# Altium project CONTROL BARRAS DE CONTEO.PrjPcb
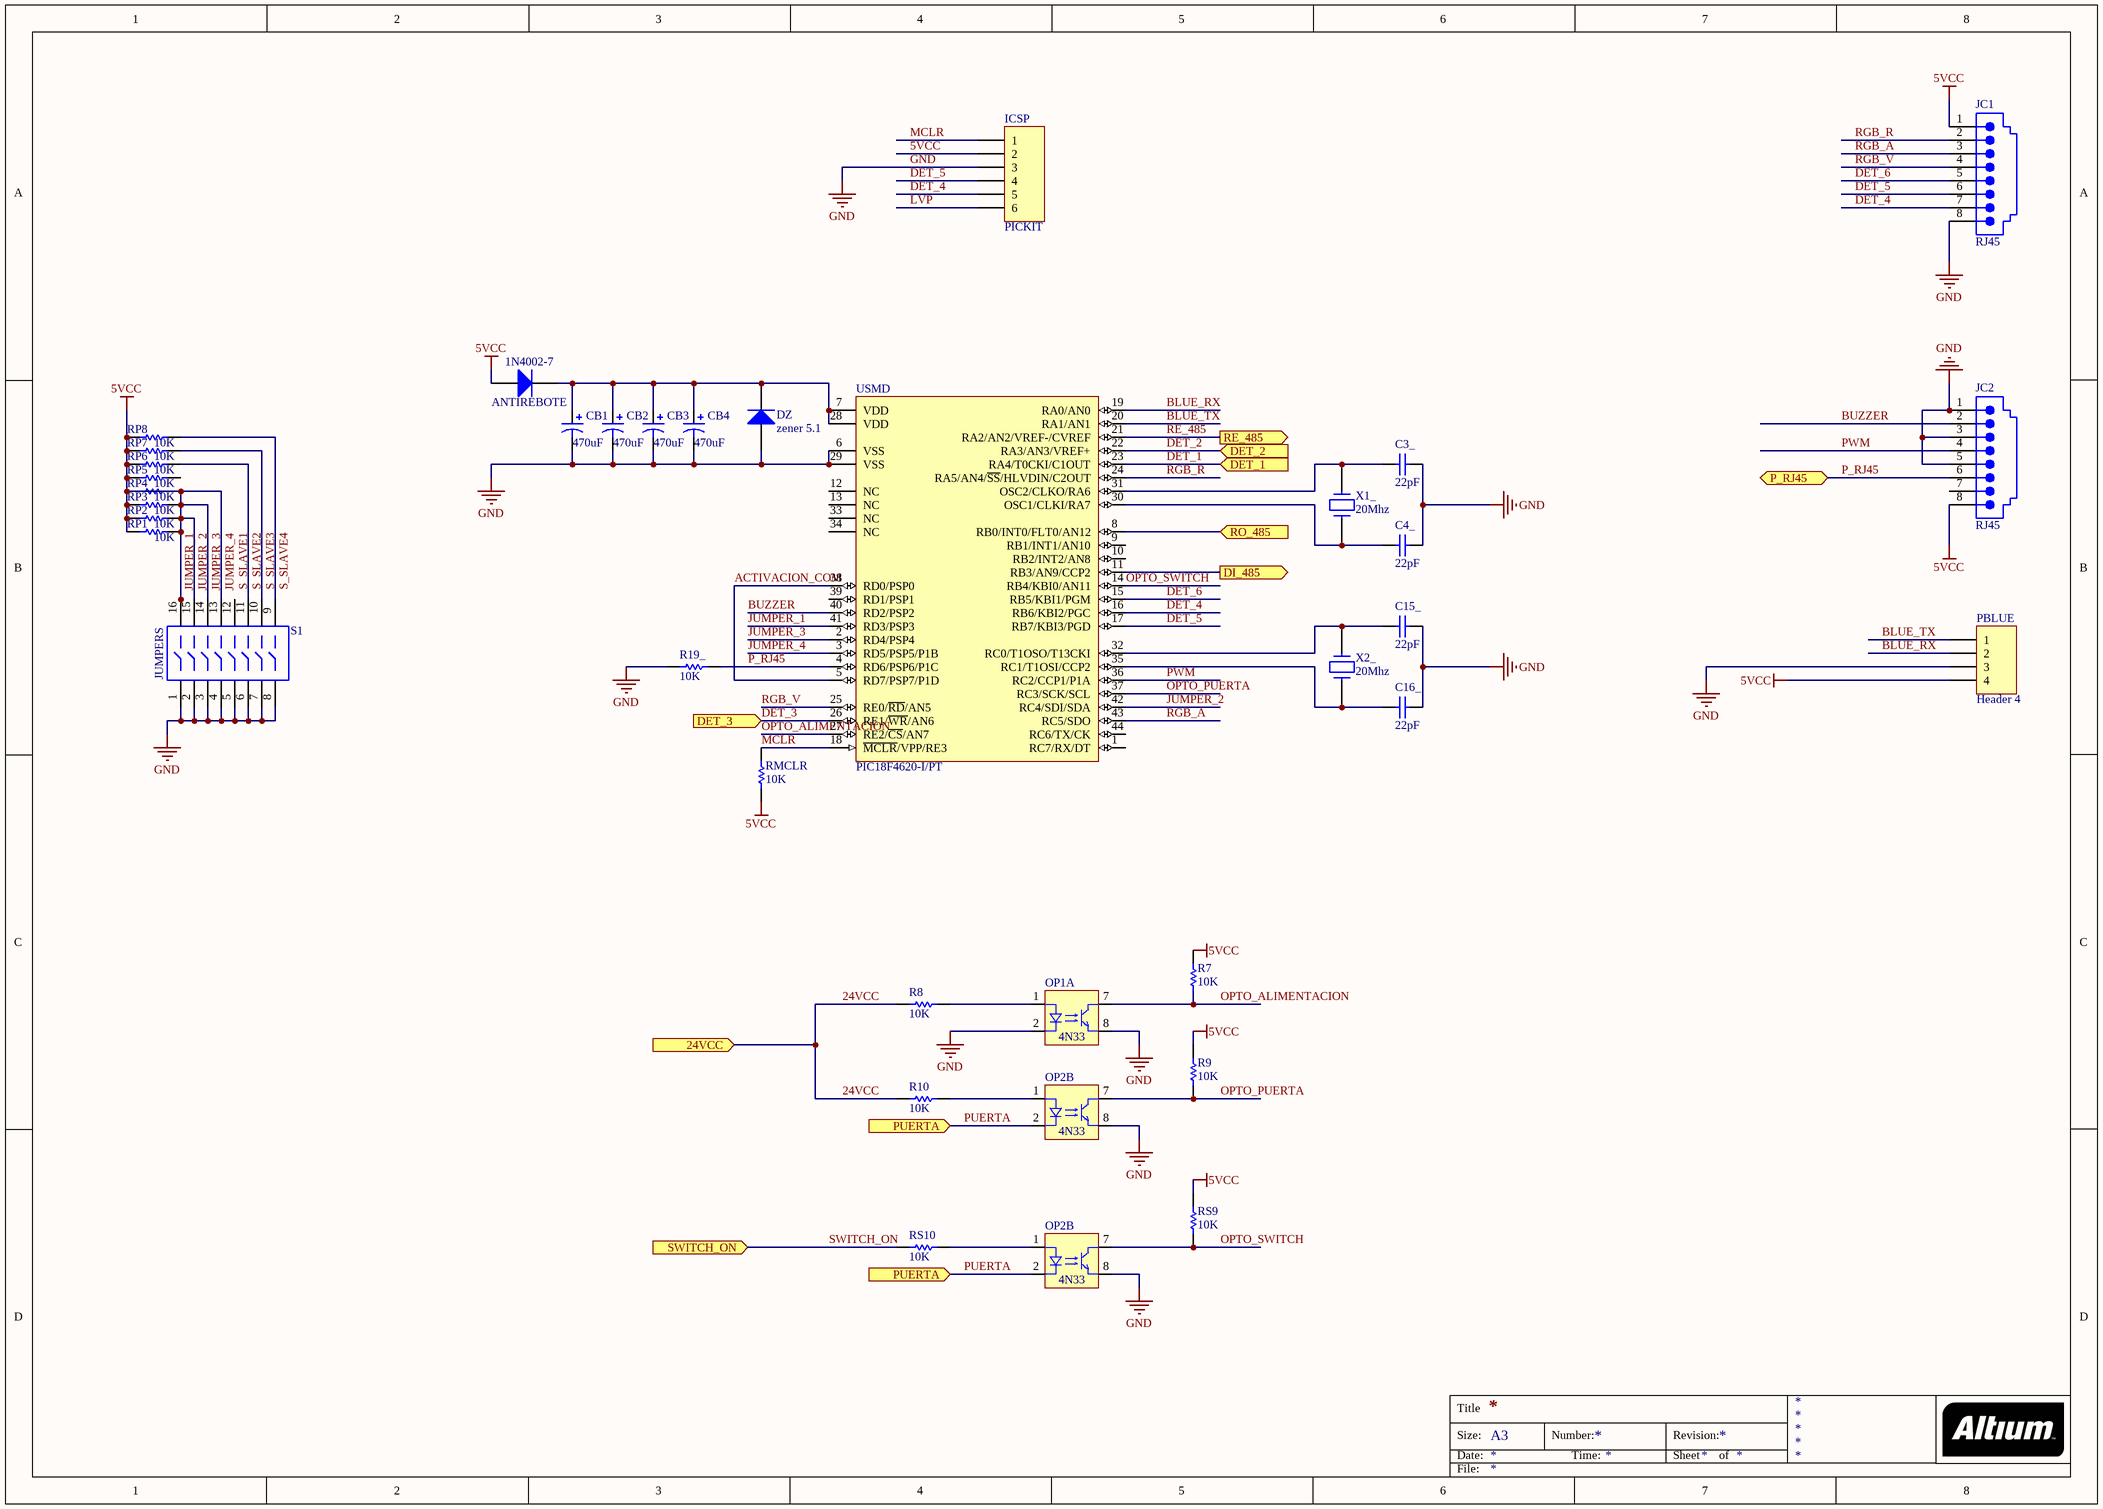
[diagram p0: MDL_CONTROL.SchDoc]
3 sheets, 58 parts. Net scope: flat (ports and power ports of the same name join across sheets).
Board file: PCB_CPU_1.PcbDoc
Sheets:
  MDL_CONTROL.SchDoc
  MDL_FUENTE_5V.SchDoc
  MDL-485.SchDoc

## Sheet MDL_CONTROL.SchDoc
size A3

### Parts
(Parts that share a designator on the sheet are numbered #1, #2 ... from top to bottom, then left to right.)
1N4002-7  ANTIREBOTE  [1N4000]
C3_  value 22pF  [VP31-2.5]  (hidden comment: VP31BA220JB)
C4_  value 22pF  [VP31-2.5]  (hidden comment: VP31BA220JB)
C15_  value 22pF  [VP31-2.5]  (hidden comment: VP31BA220JB)
C16_  value 22pF  [VP31-2.5]  (hidden comment: VP31BA220JB)
CB1  value 470uF  [C1000UF]  (hidden comment: Cap Pol1)
CB2  value 470uF  [C1000UF]  (hidden comment: Cap Pol1)
CB3  value 470uF  [C1000UF]  (hidden comment: Cap Pol1)
CB4  value 470uF  [C1000UF]  (hidden comment: Cap Pol1)
DZ  zener 5.1  [1N4000]
ICSP  PICKIT  [HDR1X6]
JC1  RJ45  [15-43-6233]
JC2  RJ45  [15-43-6233]
OP1  4N33  [4n35_4n33_6pines]  (part A of 2)
OP2#1  4N33  [4n35_4n33_6pines]  (part B of 2)
OP2#2  4N33  [4n35_4n33_6pines]  (part B of 2)
PBLUE  Header 4  [HDR1X4]
R7  value 10K  [AXIAL-0.3]  (hidden comment: Res)
R8  value 10K  [AXIAL-0.3]  (hidden comment: Res)
R9  value 10K  [AXIAL-0.3]  (hidden comment: Res)
R10  value 10K  [AXIAL-0.3]  (hidden comment: Res)
R19_  value 10K  [AXIAL-0.3]  (hidden comment: Res)
RMCLR  value 10K  [AXIAL-0.3]  (hidden comment: Res)
RP1  value 10K  [AXIAL-0.3]  (hidden comment: Res)
RP2  value 10K  [AXIAL-0.3]  (hidden comment: Res)
RP3  value 10K  [AXIAL-0.3]  (hidden comment: Res)
RP4  value 10K  [AXIAL-0.3]  (hidden comment: Res)
RP5  value 10K  [AXIAL-0.3]  (hidden comment: Res)
RP6  value 10K  [AXIAL-0.3]  (hidden comment: Res)
RP7  value 10K  [AXIAL-0.3]  (hidden comment: Res)
RP8  value 10K  [AXIAL-0.3]  (hidden comment: Res)
RS9  value 10K  [AXIAL-0.3]  (hidden comment: Res)
RS10  value 10K  [AXIAL-0.3]  (hidden comment: Res)
S1  JUMPERS  [DIP-16-KEY]
USMD  PIC18F4620-I/PT  [MCHP-TQFP-PT44_N]
X1_  20Mhz  [XTAL-1]
X2_  20Mhz  [XTAL-1]

### Ports
24VCC (in), DET_1 (in), DET_2 (in), DET_3 (in), DI_485 (out), P_RJ45 (bidir), PUERTA (in), RE_485 (out), RO_485 (in), SWITCH_ON (in)

### Nets
5VCC: 1N4002-7.1(A) ICSP.2 JC1.1 JC2.8 PBLUE.4 R7.2 R9.2 RMCLR.2 RP1.1 RP1.2 RP2.1 RP2.2 RP3.1 RP3.2 RP4.1 RP4.2 RP5.2 RP6.2 RP7.2 RP8.2 RS9.2 S1.13 S1.14 S1.15 S1.16 USMD.2(RD4/PSP4) USMD.3(RD5/PSP5/P1B) USMD.41(RD3/PSP3) USMD.42(RC4/SDI/SDA)  [also labelled JUMPER_1, JUMPER_2, JUMPER_3, JUMPER_4]
GND: C3_.2 C4_.1 C15_.2 C16_.1 CB1.2 CB2.2 CB3.2 CB4.2 DZ.1(A) ICSP.3 JC1.8 JC2.1 JC2.3 JC2.5 OP1.2(K) OP1.8(E) OP2#1.8(E) OP2#2.8(E) PBLUE.3 R19_.2 S1.1 S1.2 S1.3 S1.4 S1.5 S1.6 S1.7 S1.8 USMD.6(VSS) USMD.29(VSS)
24VCC: R8.1 R10.1 ; port 24VCC
ACTIVACION_COM: USMD.5(RD7/PSP7/P1D) USMD.38(RD0/PSP0)
BLUE_RX: PBLUE.2 USMD.19(RA0/AN0)
BLUE_TX: PBLUE.1 USMD.20(RA1/AN1)
BUZZER: JC2.2 USMD.40(RD2/PSP2)
DET_1: USMD.23(RA4/T0CKI/C1OUT) ; port DET_1
DET_2: USMD.22(RA3/AN3/VREF+) ; port DET_2
DET_3: USMD.26(RE1/~{WR}/AN6) ; port DET_3
DET_4: ICSP.5 JC1.7 USMD.16(RB6/KBI2/PGC)
DET_5: ICSP.4 JC1.6 USMD.17(RB7/KBI3/PGD)
DET_6: JC1.5 USMD.15(RB5/KBI1/PGM)
LVP: ICSP.6
MCLR: ICSP.1 RMCLR.1 USMD.18(~{MCLR}/VPP/RE3)
OPTO_ALIMENTACION: OP1.7(C) R7.1 USMD.27(RE2/~{CS}/AN7)
OPTO_PUERTA: OP2#1.7(C) R9.1 USMD.37(RC3/SCK/SCL)
OPTO_SWITCH: OP2#2.7(C) RS9.1 USMD.14(RB4/KBI0/AN11)
P_RJ45: JC2.6 R19_.1 USMD.4(RD6/PSP6/P1C) ; port P_RJ45
PUERTA: OP2#1.2(K) OP2#2.2(K) ; port PUERTA
PWM: JC2.4 USMD.36(RC2/CCP1/P1A)
RE_485: USMD.11(RB3/AN9/CCP2) USMD.21(RA2/AN2/VREF-/CVREF) ; port RE_485, port DI_485  [project net DI_485]
RGB_A: JC1.3 USMD.43(RC5/SDO)
RGB_R: JC1.2 USMD.24(RA5/AN4/~{SS}/HLVDIN/C2OUT)
RGB_V: JC1.4 USMD.25(RE0/~{RD}/AN5)
RO_485: USMD.8(RB0/INT0/FLT0/AN12) ; port RO_485
S_SLAVE2: RP6.1 S1.11
S_SLAVE3: RP7.1 S1.10
S_SLAVE4: RP8.1 S1.9
SWITCH_ON: RS10.1 ; port SWITCH_ON
Net1N4002-7_2: 1N4002-7.2(K) CB1.1 CB2.1 CB3.1 CB4.1 DZ.2(K) USMD.7(VDD) USMD.28(VDD)
NetC3__1: C3_.1 USMD.31(OSC2/CLKO/RA6) X1_.1
NetC4__2: C4_.2 USMD.30(OSC1/CLKI/RA7) X1_.2
NetC15__1: C15_.1 USMD.32(RC0/T1OSO/T13CKI) X2_.1
NetC16__2: C16_.2 USMD.35(RC1/T1OSI/CCP2) X2_.2
NetOP1_1: OP1.1(A) R8.2
NetOP2#1_1: OP2#1.1(A) R10.2
NetOP2#2_1: OP2#2.1(A) RS10.2

Not connected (* = marked no-connect by the designer): JC2 7; RP5 1; S1 12; USMD 1(RC7/RX/DT) 9(RB1/INT1/AN10) 10(RB2/INT2/AN8) 12(NC) 13(NC) 33(NC) 34(NC) 39(RD1/PSP1) 44(RC6/TX/CK)

### Notes on the sheet
- Labels drawn without touching a wire or pin: S_SLAVE1
- Title
- Size:
- Date:
- A3
- Number:
- Time:
- Revision:
- Sheet
- of
- File:

### Library data of the parts
1N4002-7 DZ = Diodo: Diodo rectificador
C3_ C4_ C15_ C16_ = VP31BA220JB: Dipped Radial Multilayer Ceramic Capacitor COG (NPO): 22pF, 100V; Note: See Datasheet for other packages & tolerances; Published: 17-Dec-2003; DatasheetDocument: 2-Jan-2002; PackageDocument: 8-Feb-2002; PackageReference: VP31-2.5; Publisher: Altium Limited; ComponentLink1Description: Manufacturer Link; ComponentLink1URL: http://www.vishay.com/
CB1-CB4 = Cap Pol1: Polarized Capacitor (Radial); Published: 8-Jun-2000; LatestRevisionDate: 17-Jul-2002; LatestRevisionNote: Re-released for DXP Platform.; PackageReference: RB7.6-15; Publisher: Altium Limited
ICSP = Header 6: Header, 6-Pin; LatestRevisionDate: 17-Jul-2002; LatestRevisionNote: Re-released for DXP Platform.; Publisher: Altium Limited
JC1 JC2 = 15-43-6233: Right Angle, Standard Profile, RJ45-Keyed, Flange Mount PCB Jack; Ports: 1; Positions/Loaded: Port1 - 8 Keyed/8; PerformanceCategory: 3; PCB_Mounting: Thru-Hole; ComponentAvailability: Obsolete; DrillSize: Nominal, Rounded to nearest 0.05mm; PCB_Layout: Complies with Manufacturer's Recommendation.; Published: 25-Jun-2002; DatasheetDocument: 18-Dec-2001; PackageDocument: 18-Dec-2001; PackageReference: 15-43-6233; Publisher: Altium Limited; ComponentLink1Description: Manufacturer Link; ComponentLink1URL: http://www.molex.com/; ComponentLink2Description: Datasheet; ComponentLink2URL: http://www.molex.com/cmc_upload/common_files/1212003_catalogmx41314.pdf; ComponentLink3Description: Iges Model; ComponentLink3URL: http://www.molex.com/pdm_docs/igs/15-43-6233_igs.zip
OP1 OP2#1 OP2#2 = ILD74: Optocoupler, Phototransistor Output, Dual Channel, TTL Compatible, Pb-free; Note: Coupling Capacitance, 0.5 pF; Note: Transfer Ratio, 35 % Typical; Published: 6-Oct-2005; DatasheetDocument: Rev. 1.4, Oct-2004; PackageDocument: Dec-2003; PackageReference: DIP8; Publisher: Altium Limited; ComponentLink1Description: Manufacturer Link; ComponentLink1URL: http://www.vishay.com/optocouplers/list/product-83640/; ComponentLink2Description: Datasheet; ComponentLink2URL: http://www.vishay.com/docs/83640/83640.pdf
PBLUE = Header 4: Header, 4-Pin; LatestRevisionDate: 17-Jul-2002; LatestRevisionNote: Re-released for DXP Platform.; Publisher: Altium Limited
R7-R10 R19_ RMCLR RP1-RP8 RS9 RS10 = Res1: Resistor; Published: 8-Jun-2000; LatestRevisionDate: 17-Jul-2002; LatestRevisionNote: Re-released for DXP Platform.; PackageReference: AXIAL-0.3; Publisher: Altium Limited
S1 = SW-DIP8: 4009 Series DIP Switch, Raised actuator; Published: 24-Mar-1999; LatestRevisionDate: 17-Dec-2003; LatestRevisionNote: PCB Footprint replaced.; PackageReference: DIP-16-KEY; Publisher: Altium Limited; PackageDescription: DIP; 16 Leads; Row Spacing 7.62 mm; Pitch 2.54 mm; ComponentLink1Description: Manufacturer Link; ComponentLink1URL: http://www.oupiin.com/prodindx.html#Headers
USMD = PIC18F4620-I/PT: Enhanced Flash Microcontroller with 10-Bit A/D and nanoWatt Technology, 64K Flash, 44-Pin TQFP, Industrial Temperature Range; Manufacturer: Microchip; DatasheetVersion: revE, May-2008; PackageVersion: C04-076B, 12/2012; PackageReference: TQFP-PT44; PackageDescription: 44-Lead Plastic Thin Quad Flatpack, 10 x 10 mm Body, 0.8 mm Pitch; PartNumber: PIC18F4620-I/PT; ComponentLink1Description: Manufacturer URL; ComponentLink1URL: http://www.microchip.com/; ComponentLink2Description: Datasheet; ComponentLink2URL: http://ww1.microchip.com/downloads/en/DeviceDoc/39626e.pdf; ComponentLink3Description: Package Specification; ComponentLink3URL: http://www.microchip.com/stellent/groups/techpub_sg/documents/packagingspec/en012702.pdf
X1_ X2_ = Cristal de cuarzo: X1: 20Mhz

## Sheet MDL_FUENTE_5V.SchDoc
size A4
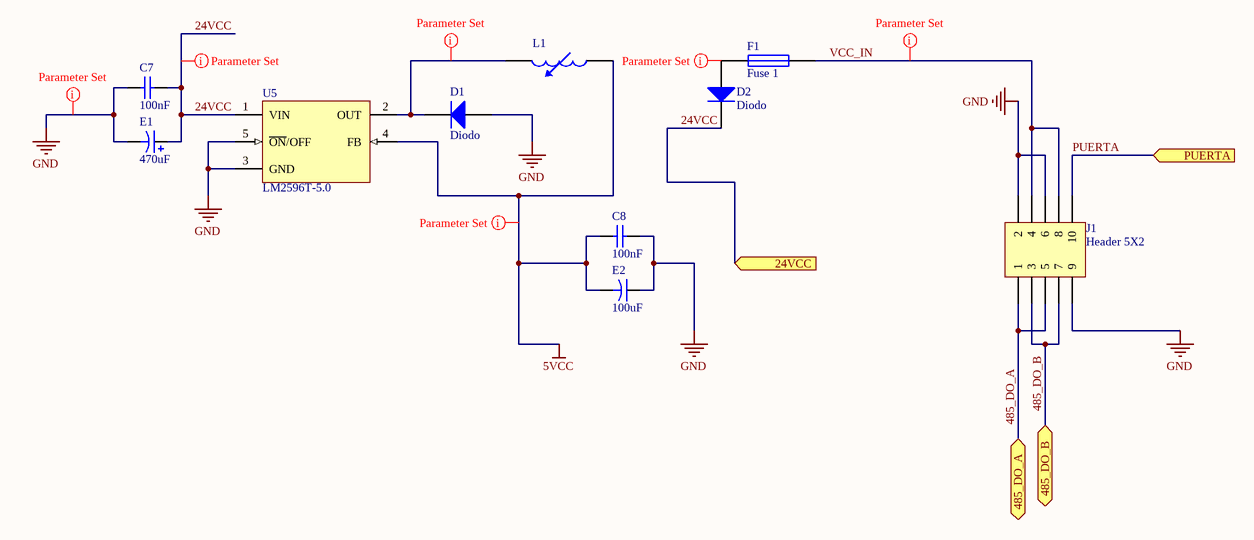
[diagram p1: MDL_FUENTE_5V.SchDoc]

### Parts
C7  value 100nF  [VP44-2.5]  (hidden comment: VP44BY224JB)
C8  value 100nF  [VP44-2.5]  (hidden comment: VP44BY224JB)
D1  Diodo  [1N4000]
D2  Diodo  [1N4000]
E1  value 470uF  [C1000UF]  (hidden comment: Cap Pol1)
E2  value 100uF  [C1UF]  (hidden comment: Cap2)
F1  Fuse 1  [FUSIBLE_BUSMATIC]
J1  Header 5X2  [FP_CON10]
L1  Inductor Adj  [Inductor_redondo]  (value not drawn)
U5  LM2596T-5.0  [FP_LM2596_D_PCB]

### Ports
24VCC (in), 485_DO_A, 485_DO_B, PUERTA (in)

### Nets
5VCC: C8.2 E2.2 L1.1 U5.4(FB)
GND: C7.2 C8.1 D1.1(A) E1.2 E2.1 J1.2 J1.6 J1.9 U5.3(GND) U5.5(~{ON}/OFF)
24VCC: C7.1 D2.2(K) E1.1 U5.1(VIN) ; port 24VCC
485_DO_A: J1.1 J1.5 ; port 485_DO_A
485_DO_B: J1.3 J1.7 ; port 485_DO_B
PUERTA: J1.10 ; port PUERTA
VCC_IN: F1.2 J1.4 J1.8
NetD1_2: D1.2(K) L1.2 U5.2(OUT)
NetD2_1: D2.1(A) F1.1

### Layout directives
rule Width Constraint [Pref Width = 1.2mm    Min Width = 0.8mm    Max Width = 1.5mm]: GND
rule Width Constraint [Pref Width = 1.5mm    Min Width = 1.2mm    Max Width = 2mm]: 24VCC, VCC_IN
rule Width Constraint [Pref Width = 1.2mm    Min Width = 0.8mm    Max Width = 1.5mm]; rule Undefined: 5VCC
rule Width Constraint [Pref Width = 1.5mm    Min Width = 0.8mm    Max Width = 1.5mm]: NetD1_2
rule Width Constraint [Pref Width = 1.8mm    Min Width = 1.2mm    Max Width = 2mm]: NetD2_1

### Library data of the parts
C7 C8 = VP44BY224JB: Dipped Radial Multilayer Ceramic Capacitor X7R: 220nF, 100V; Published: 17-Dec-2003; DatasheetDocument: 4-Feb-2002; PackageDocument: 4-Feb-2002; PackageReference: VP44-2.5; Publisher: Altium Limited; ComponentLink1Description: Manufacturer Link; ComponentLink1URL: http://www.vishay.com/
D1 D2 = Diodo: Diodo rectificador
E1 = Cap Pol1: Polarized Capacitor (Radial); Published: 8-Jun-2000; LatestRevisionDate: 17-Jul-2002; LatestRevisionNote: Re-released for DXP Platform.; PackageReference: RB7.6-15; Publisher: Altium Limited
E2 = Cap2: Capacitor; Published: 23-Sep-2002; PackageReference: CAPR5-4X5; Publisher: Altium Limited; PackageDescription: Capacitor; 2 Leads
F1 = Fuse 1: Fuse; Published: 8-Jun-2000; LatestRevisionDate: 17-Jul-2002; LatestRevisionNote: Re-released for DXP Platform.; PackageReference: PIN-W2/E2.8; Publisher: Altium Limited; PackageDescription: Thru-Hole; 2 Leads
J1 = Header 5X2: Header, 5-Pin, Dual row; LatestRevisionDate: 17-Jul-2002; LatestRevisionNote: Re-released for DXP Platform.; Publisher: Altium Limited
L1 = Inductor Adj: Adjustable Inductor; Value: 10mH; Set Position: 0.5; Published: 24-Mar-1999; LatestRevisionDate: 17-Jul-2002; LatestRevisionNote: Re-released for DXP Platform.; PackageReference: AXIAL-0.8; Publisher: Altium Limited
U5 = LM2596T-5.0: SIMPLE SWITCHER Power Converter 150 KHz 3A Step-Down Voltage Regulator; Manufacturer: National Semiconductor; PackageTopMarking: NSUZXYTT*LM2596T*-5.0 P+; PowerWise: N; FirstPublished: 4-Dec-2008; DatasheetVersion: May-2002; PackageVersion: revA, Oct-1989; PackageReference: T05D; Publisher: Altium Limited; PackageDescription: TO-220, Molded, Stagger Bend, 5 Lead; CompType: Switcher; PartNumber: LM2596T-5.0; RoHS: O; PinCount: 5; DigiKeyPartNumber: LM2596T-5.0-ND; ComponentLink1Description: LM2596 Datasheet; ComponentLink1URL: http://www.national.com/ds/LM/LM2596.pdf; ComponentLink2Description: LM2596 Web Page; ComponentLink2URL: http://www.national.com/pf/LM/LM2596.html; ComponentLink3Description: T05D Package Page; ComponentLink3URL: http://www.national.com/packaging/folders/t05d.html

## Sheet MDL-485.SchDoc
size A4; DocumentNumber: 4; SheetNumber: 4
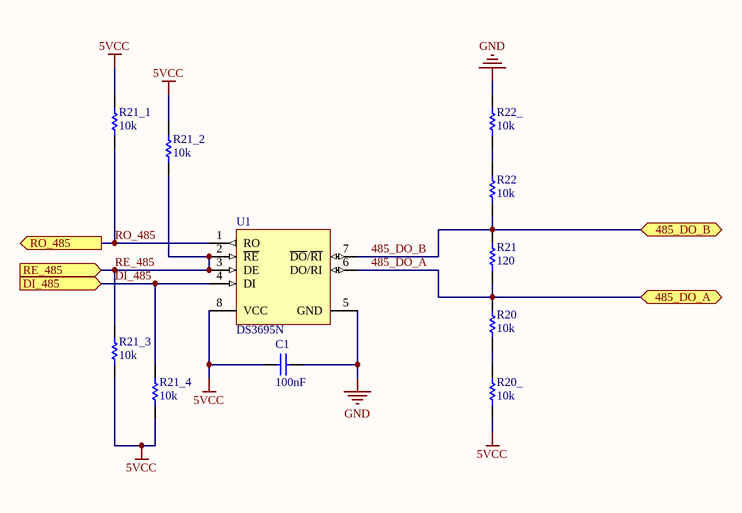
[diagram p2: MDL-485.SchDoc]

### Parts
C1  value 100nF  [VP44-2.5]  (hidden comment: VP44BY224JB)
R20  value 10k  [AXIAL-0.3]  (hidden comment: Res1)
R20_  value 10k  [AXIAL-0.3]  (hidden comment: Res1)
R21  value 120  [AXIAL-0.3]  (hidden comment: Res1)
R21_1  value 10k  [AXIAL-0.3]  (hidden comment: Res1)
R21_2  value 10k  [AXIAL-0.3]  (hidden comment: Res1)
R21_3  value 10k  [AXIAL-0.3]  (hidden comment: Res1)
R21_4  value 10k  [AXIAL-0.3]  (hidden comment: Res1)
R22  value 10k  [AXIAL-0.3]  (hidden comment: Res1)
R22_  value 10k  [AXIAL-0.3]  (hidden comment: Res1)
U1  DS3695N  [N08E]

### Ports
485_DO_A (bidir), 485_DO_B (bidir), DI_485 (in), RE_485 (in), RO_485 (out)

### Nets
5VCC: C1.1 R20_.1 R21_1.2 R21_2.2 R21_3.1 R21_4.1 U1.8(VCC)
GND: C1.2 R22_.2 U1.5(GND)
485_DO_A: R20.2 R21.1 U1.6(DO/RI) ; port 485_DO_A
485_DO_B: R21.2 R22.1 U1.7(~{DO}/~{RI}) ; port 485_DO_B
DI_485: R21_2.1 R21_3.2 R21_4.2 U1.2(~{RE}) U1.3(DE) U1.4(DI) ; port RE_485, port DI_485  [also labelled RE_485]
RO_485: R21_1.1 U1.1(RO) ; port RO_485
NetR20_1: R20.1 R20_.2
NetR22_2: R22.2 R22_.1

### Library data of the parts
C1 = VP44BY224JB: as C7 on sheet MDL_FUENTE_5V; Published: 17-Dec-2003; DatasheetDocument: 4-Feb-2002; PackageDocument: 4-Feb-2002; PackageReference: VP44-2.5; Publisher: Altium Limited; ComponentLink1Description: Manufacturer Link; ComponentLink1URL: http://www.vishay.com/
R20 R20_ R21 R21_1-R21_4 R22 R22_ = Res1: Resistor; Published: 8-Jun-2000; LatestRevisionDate: 17-Jul-2002; LatestRevisionNote: Re-released for DXP Platform.; PackageReference: AXIAL-0.3; Publisher: Altium Limited; PackageDescription: Axial Device, Thru-Hole; 2 Leads; 0.3 in Pin Spacing
U1 = DS3695N: Multipoint RS485/RS422 Transceiver/Repeater; Manufacturer: National Semiconductor; CompType: Interface IC; PackageTopMarking: NSUZXYTT*DS3695N; PowerWise: N; Published: 4-Dec-2008; DatasheetVersion: May-1998; PackageVersion: revG, May-2006; PackageReference: N08E; Publisher: Altium Limited; PackageDescription: MDIP, .365 x .250 x .130in, 8 Lead, .100in Pitch; PartNumber: DS3695N; RoHS: O; PinCount: 8; DigiKeyPartNumber: DS3695N-ND; Code_JEDEC: MS-001-BA; ComponentLink1Description: DS3695 Datasheet; ComponentLink1URL: http://www.national.com/ds/DS/DS3695.pdf; ComponentLink2Description: DS3695 Web Page; ComponentLink2URL: http://www.national.com/pf/DS/DS3695.html; ComponentLink3Description: N08E Package Page; ComponentLink3URL: http://www.national.com/packaging/folders/n08e.html

## Nets that join several sheets
5VCC: MDL_CONTROL (29 pins), MDL_FUENTE_5V (C8.2 E2.2 L1.1 U5.4), MDL-485 (7 pins)
GND: MDL_CONTROL (30 pins), MDL_FUENTE_5V (10 pins), MDL-485 (C1.2 R22_.2 U1.5)
24VCC: MDL_CONTROL (R8.1 R10.1), MDL_FUENTE_5V (C7.1 D2.2 E1.1 U5.1)
485_DO_A: MDL_FUENTE_5V (J1.1 J1.5), MDL-485 (R20.2 R21.1 U1.6)
485_DO_B: MDL_FUENTE_5V (J1.3 J1.7), MDL-485 (R21.2 R22.1 U1.7)
DI_485: MDL_CONTROL (USMD.11 USMD.21), MDL-485 (6 pins)
PUERTA: MDL_CONTROL (OP2#1.2 OP2#2.2), MDL_FUENTE_5V (J1.10)
RO_485: MDL_CONTROL (USMD.8), MDL-485 (R21_1.1 U1.1)